# EAGLE design usb-shock-buzzer (EAGLE 7.6.0)
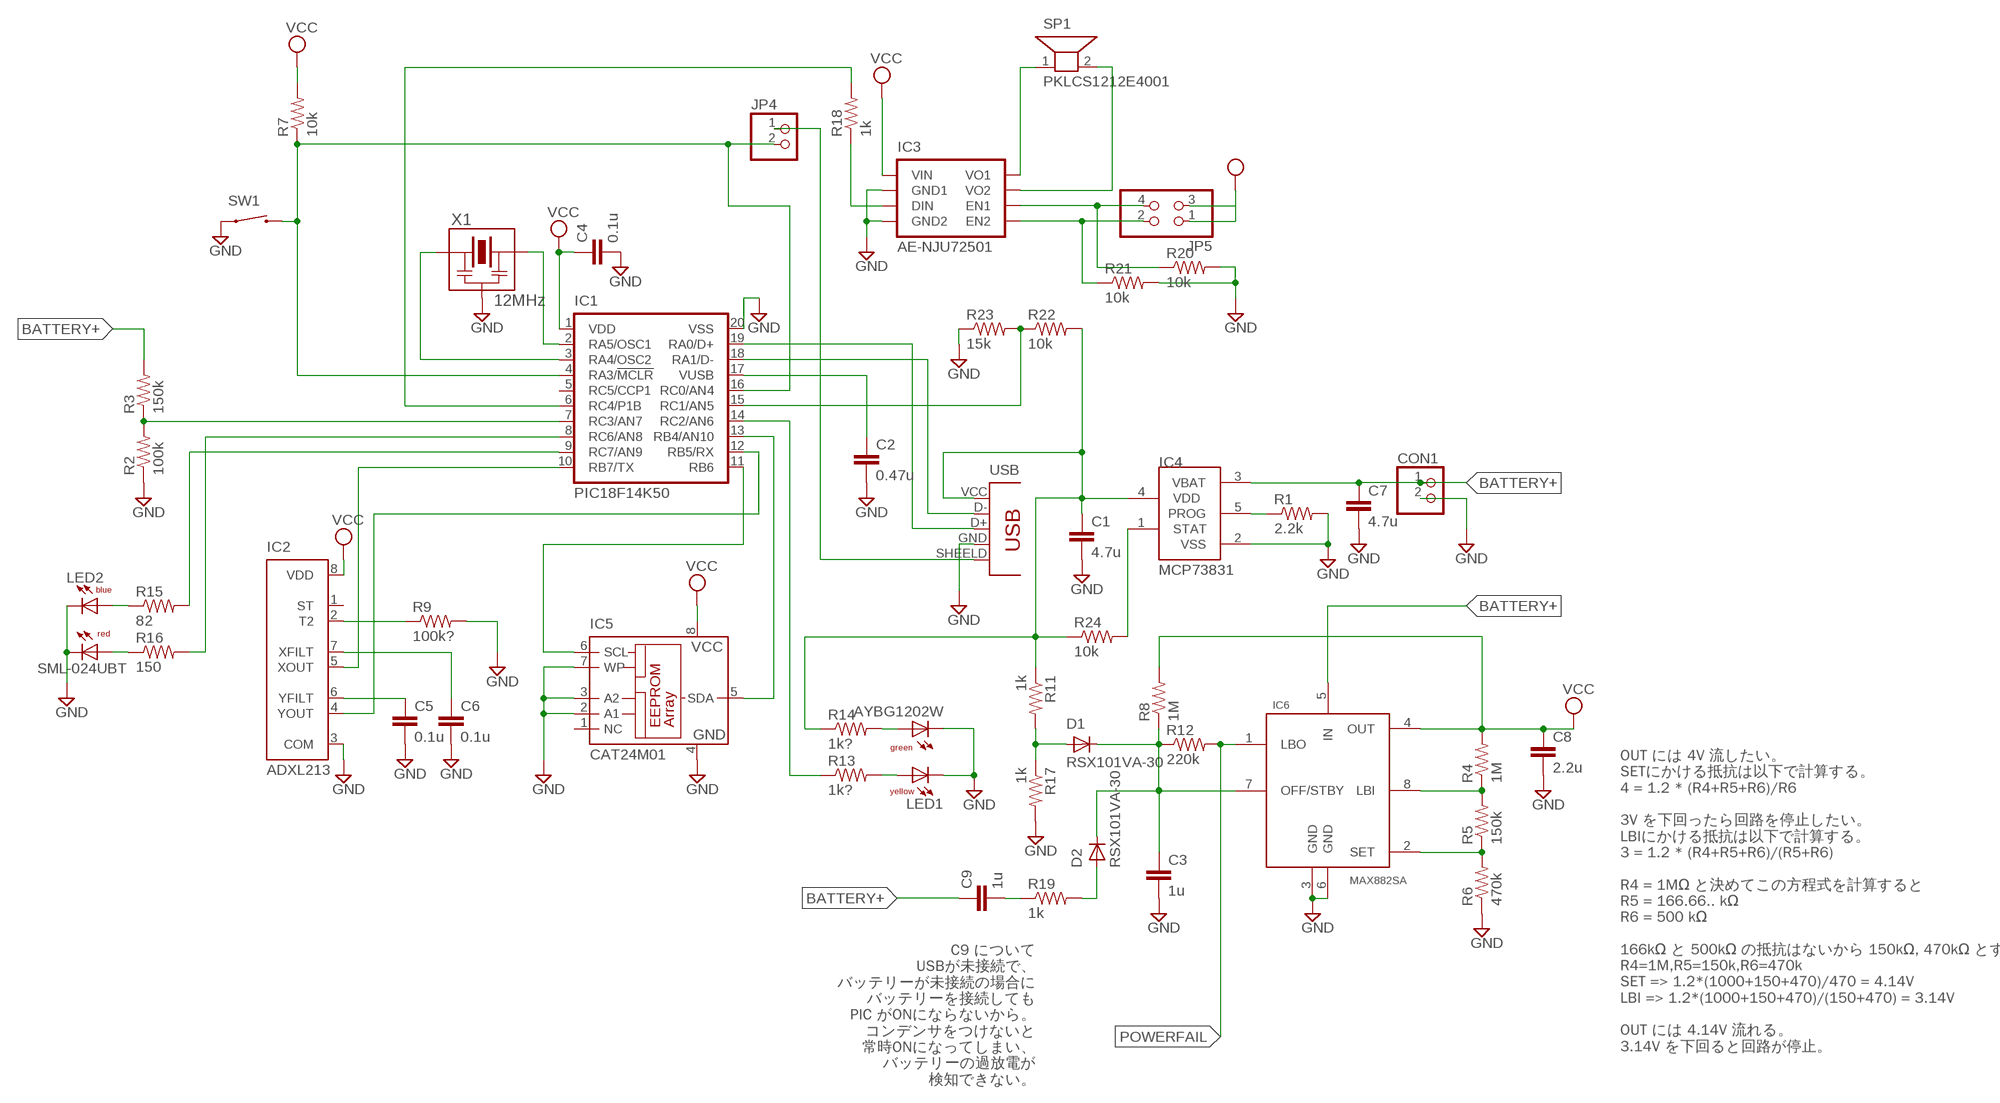
[diagram p0: schematic, sheet 1]

## Parts
C1  4.7u  C-EUC0805  [C0805]
C2  0.47u  C-EUC0805  [C0805]
C3  1u  C-EUC0805  [C0805]
C4  0.1u  C-EUC0805  [C0805]
C5  0.1u  C-EUC0805  [C0805]
C6  0.1u  C-EUC0805  [C0805]
C7  4.7u  C-EUC0805  [C0805]
C8  2.2u  C-EUC1206  [C1206]
C9  1u  C-EUC0805  [C0805]
CON1  PH-2PIN  [PH-2PIN]
D1  RSX101VA-30  [RSX101VA]
D2  RSX101VA-30  [RSX101VA]
IC1  PIC18F14K50  [SO20]
IC2  ADXL213  [LCC8]
IC3  AE-NJU72501  [AE-NJU72501]
IC4  MCP73831  [SOT23-5L]
IC5  CAT24M01  [SOIC]
IC6  MAX882SA  [8-SO]
JP4  PINHD-1X2  [1X02]
JP5  PINHD-2X2  [2X02]
LED1  AYBG1202W  [AYBG1202W]
LED2  SML-024UBT  2COLOR-BR  [SML-02]
R1  2.2k  R-US_M0805  [M0805]
R2  100k  R-US_M0805  [M0805]
R3  150k  R-US_M0805  [M0805]
R4  1M  R-US_R0805  [R0805]
R5  150k  R-US_M0805  [M0805]
R6  470k  R-US_M0805  [M0805]
R7  10k  R-US_M0805  [M0805]
R8  1M  R-US_M0805  [M0805]
R9  100k?  R-US_M0805  [M0805]
R11  1k  R-US_M0805  [M0805]
R12  220k  R-US_M0805  [M0805]
R13  1k?  R-US_M0805  [M0805]
R14  1k?  R-US_M0805  [M0805]
R15  82  R-US_M0805  [M0805]
R16  150  R-US_M0805  [M0805]
R17  1k  R-US_M0805  [M0805]
R18  1k  R-US_M0805  [M0805]
R19  1k  R-US_M0805  [M0805]
R20  10k  R-US_M0805  [M0805]
R21  10k  R-US_M0805  [M0805]
R22  10k  R-US_M0805  [M0805]
R23  15k  R-US_M0805  [M0805]
R24  10k  R-US_M0805  [M0805]
SP1  PKLCS1212E4001  [PKLCS1212E4001]
SW1  TVBP06  [TVBP06]
USB  TYPE-A+SHILED  [TYPE-A]
X1  12MHz  CSTCE12M0G15L  [CSTCE]

## Nets
BATTERY+ [Power]: C7.1 C9.1 CON1.1 IC4.3(VBAT) IC6.5(IN) R3.2
GND [Power]: C1.2 C2.2 C3.2 C4.2 C5.2 C6.2 C7.2 C8.2 CON1.2 IC1.20(VSS) IC2.3(COM) IC3.2(GND1) IC3.4(GND2) IC4.2(VSS) IC5.2(A1) IC5.3(A2) IC5.4(GND) IC5.7(WP) IC6.3(GND) IC6.6(GND) LED1.2(CC1) LED1.4(CC2) LED2.1(CC1) LED2.3(CC2) R1.2 R2.1 R6.1 R9.2 R17.2 R20.2 R21.2 R23.1 SW1.1 USB.GND X1.2(GND)
N$1 [Power]: IC3.6(EN1) JP5.4 R20.1
N$2: IC1.18(RA1/D-) USB.D-
N$3: IC1.19(RA0/D+) USB.D+
N$4: IC4.5(PROG) R1.1
N$5: IC1.9(RC7/AN9) R15.2
N$6: JP4.1 USB.SHEELD
N$7: C2.1 IC1.17(VUSB)
N$8: IC1.7(RC3/AN7) R2.2 R3.1
N$9: IC6.8(LBI) R4.1 R5.2
N$10: IC1.11(RB6) IC5.6(SCL)
N$11: IC1.13(RB4/AN10) IC5.5(SDA)
N$12: C5.1 IC2.6(YFILT)
N$13: C6.1 IC2.7(XFILT)
N$14: IC1.10(RB7/TX) IC2.5(XOUT)
N$15: IC1.12(RB5/RX) IC2.4(YOUT)
N$16: C9.2 R19.1
N$17: IC2.2(T2) R9.1
N$18: IC1.8(RC6/AN8) R16.2
N$19: IC3.8(VO1) SP1.1
N$20: IC3.7(VO2) SP1.2
N$21: IC1.4(RA3/!MCLR!) IC1.16(RC0/AN4) JP4.2 R7.1 SW1.2
N$22: LED1.3(A2) R14.2
N$23: LED1.1(A1) R13.2
N$24: LED2.4(AR) R16.1
N$25: IC3.3(DIN) R18.1
N$26: IC1.2(RA5/OSC1) X1.3(RIT)
N$27: IC1.15(RC1/AN5) R22.1 R23.2
N$28: IC1.3(RA4/OSC2) X1.1(LFT)
N$29: IC6.2(SET) R5.1 R6.2
N$30: IC1.6(RC4/P1B) R18.2
N$31: IC1.14(RC2/AN6) R13.1
N$32: D2.ANODE(A) R19.2
N$33: LED2.2(AB) R15.1
N$34: C3.1 D1.CATHODE(C) D2.CATHODE(C) IC6.7(OFF/STBY) R8.1 R12.1
N$35: D1.ANODE(A) R11.2 R17.1
N$36 [Power]: IC3.5(EN2) JP5.2 R21.1
N$37: IC4.1(STAT) R24.2
POWERFAIL: IC6.1(LBO) R12.2
USB_VCC [Power]: C1.1 IC4.4(VDD) R11.1 R14.1 R22.2 R24.1 USB.VCC
VCC [Power]: C4.1 C8.1 IC1.1(VDD) IC2.8(VDD) IC3.1(VIN) IC5.8(VCC) IC6.4(OUT) JP5.1 JP5.3 R4.2 R7.2 R8.2
Unconnected: IC1.5(RC5/CCP1) IC2.1(ST) IC5.1(NC)

## Notes on the sheet
- C9 について
  USBが未接続で、
  バッテリーが未接続の場合に
  バッテリーを接続しても
  PIC がONにならないから。
  コンデンサをつけないと
  常時ONになってしまい、
  バッテリーの過放電が
  検知できない。
- OUT には 4V 流したい。
  SETにかける抵抗は以下で計算する。
  4 = 1.2 * (R4+R5+R6)/R6
  
  3V を下回ったら回路を停止したい。
  LBIにかける抵抗は以下で計算する。
  3 = 1.2 * (R4+R5+R6)/(R5+R6)
  
  R4 = 1MΩ と決めてこの方程式を計算すると
  R5 = 166.66.. kΩ
  R6 = 500 kΩ
  
  166kΩ と 500kΩ の抵抗はないから 150kΩ, 470kΩ とする
  R4=1M,R5=150k,R6=470k
  SET => 1.2*(1000+150+470)/470 = 4.14V
  LBI => 1.2*(1000+150+470)/(150+470) = 3.14V
  
  OUT には 4.14V 流れる。
  3.14V を下回ると回路が停止。

## Library data of the parts
C1-C9 = rcl:C-EU: CAPACITOR, European symbol
CON1 = connectors:PH-2PIN
D1 D2 = diodes:RSX101VA-30
IC1 = pic18f14k50:PIC18F14K50
IC2 = adxl213:ADXL213: Low-Cost +-2 g Dual-Axis Accelerometer with Duty Cycle Output Source: http://www.analog.com/media/en/technical-documentation/data-sheets/ADXL213.pdf
IC3 = ae-nju72501:AE-NJU72501
IC4 = mcp73831:MCP73831: Miniature Single-Cell, Fully Integrated Li-Ion, Li-Polymer Charge Management Controllers
IC5 = cat24m01:CAT24M01: Serial EEPROM 1Mbit (128KB)
IC6 = max882:MAX882*: MAX882 Low-Dropout, Adjustable Linear Regulators 200 mA, 5V/3.3V This is SMD library only. Created by: Razi Raslan; Ragnar Granit Institute; Tampere University of Technology.
JP4 = pinhead:PINHD-1X2: PIN HEADER
JP5 = pinhead:PINHD-2X2: PIN HEADER
LED1 = led-smd:AYBG1202W
LED2 = led-smd:2COLOR-BR: 2color led http://akizukidenshi.com/catalog/g/gI-09437/
R1-R9 R11-R24 = rcl:R-US_: RESISTOR, American symbol
SP1 = pklcs1212e4001-r1:PKLCS1212E4001
SW1 = switches:TVBP06: 2pin switch. http://akizukidenshi.com/catalog/g/gP-08074/
USB = usb-connector:TYPE-A+SHILED
X1 = murata-ceralok:CSTCE12M0G15L: Murata CERALOCK https://jp.rs-online.com/web/p/ceramic-resonators/7926527/

## Net classes
0 default: width 0.203 mm, drill 0.203 mm, clearance 0.203 mm
1 Power: width 0.508 mm, drill 0.508 mm, clearance 0.406 mm

## Board
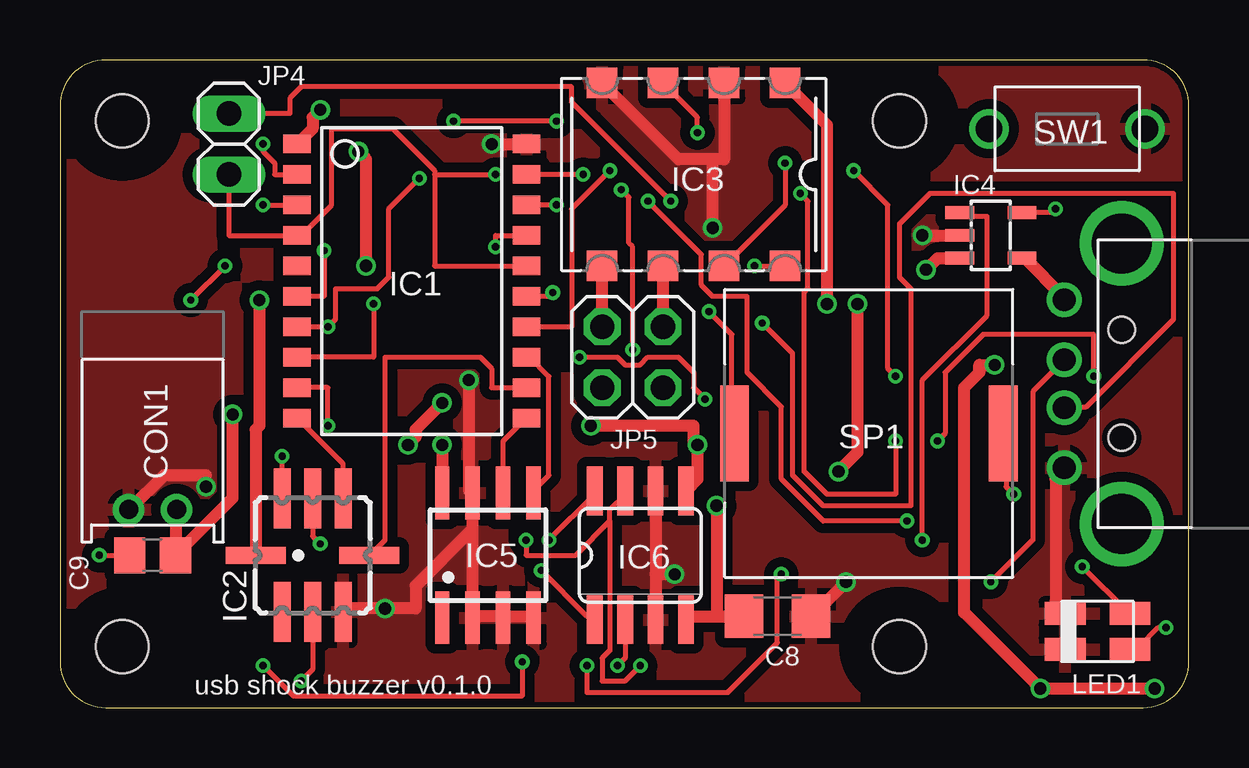
[diagram p1: board, top side]
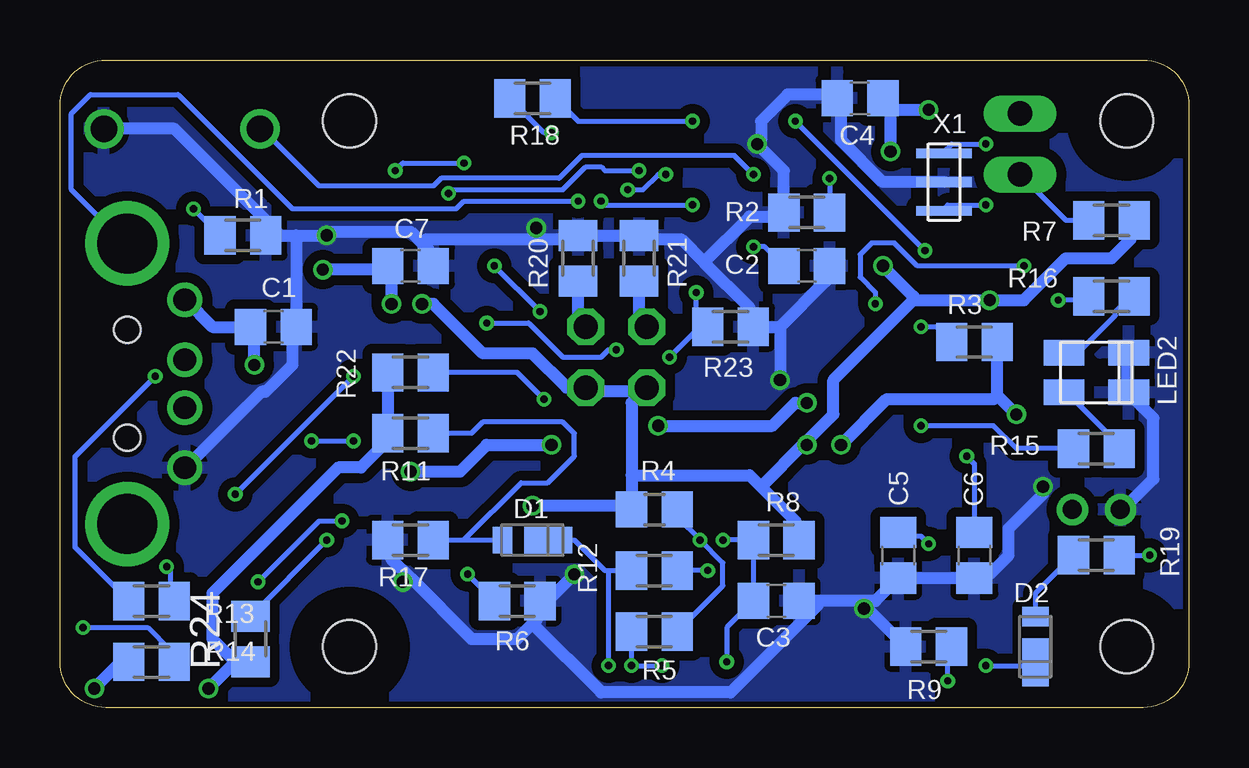
[diagram p2: board, bottom side, seen from below]

Size 47.04 x 27 mm. Coordinates in mm from the lower left corner, seen from the top.
Outline: 0,25.09 0,1.91 arc90 1.91,0 45.14,0 arc90 47.04,1.91 47.04,25.09 arc90 45.14,27 1.91,27 arc90 0,25.09
Copper layers (1*16): Top 0.035mm / dielectric 1.5mm / Bottom 0.035mm
Design rules "ssci_SeeedStudio_2layer_DRU_no_angle": minimum track width 6mil, minimum drill 12mil, track to track 6mil, track to pad 6mil, pad to pad 6mil, via to via 6mil, smd to smd 0mil, copper to edge 10mil, drill to drill 10mil, minimum pad ring 10mil, minimum via ring 6mil, stop-mask expansion 2mil, vias tented up to drill 25mil, thermal gap 10mil
Holes 2.2 mm at 34.98,24.46 34.98,2.54 2.59,2.54 2.59,24.46
bKeepout: area 11,11 to 17,17
tRestrict: area 0.1,22 to 5.1,27; area 32.5,22 to 37.5,27; area 32.5,0 to 37.5,5; area 0.1,0 to 5.1,5
bRestrict: area 32.5,22 to 37.5,27; area 32.5,0 to 37.5,5; area 0.1,0 to 5.1,5; area 0.1,22 to 5.1,27

### Footprints (pad centres in the part's own frame; a part is rotated, then mirrored left to right if it is on the bottom)
C0805 = smd 1.3 x 1.5: 1 -0.95,0; 2 0.95,0
C1206 = smd 1.6 x 1.8: 1 -1.4,0; 2 1.4,0
PH-2PIN = drill 0.8: 1 1,0; 2 -1,0
RSX101VA = smd 0.8 x 1.1: ANODE -1.25,0 | smd 2 x 1.1: CATHODE 0.65,0
SO20 = smd 0.762 x 1.143: 1 -5.08,-4.788; 2 -3.81,-4.788; 3 -2.54,-4.788; 4 -1.27,-4.788; 5 0,-4.788; 6 1.27,-4.788; 7 2.54,-4.788; 8 3.81,-4.788; 9 5.08,-4.788; 10 6.35,-4.788; 11 6.35,4.788; 12 5.08,4.788; 13 3.81,4.788; 14 2.54,4.788; 15 1.27,4.788; 16 0,4.788; 17 -1.27,4.788; 18 -2.54,4.788; 19 -3.81,4.788; 20 -5.08,4.788
LCC8 = smd 2.5 x 0.7: 1 -2.367,1.27; 2 -2.367,0; 3 -2.367,-1.27; 5 2.367,-1.27; 6 2.367,0; 7 2.367,1.27 | smd 0.7 x 2.5: 4 0,-2.367; 8 0,2.367
AE-NJU72501 = smd 1.27 x 1.27: 1 -3.81,3.81; 2 -3.81,1.27; 3 -3.81,-1.27; 4 -3.81,-3.81; 5 3.81,-3.81; 6 3.81,-1.27; 7 3.81,1.27; 8 3.81,3.81
SOT23-5L = smd 0.533 x 1.2: 1 -0.95,-1.3; 2 0,-1.3; 3 0.95,-1.3 | smd 0.55 x 1.2: 4 0.95,1.3; 5 -0.95,1.3
SOIC = smd 0.6 x 2.2: 1 -1.905,-2.6; 2 -0.635,-2.6; 3 0.635,-2.6; 4 1.905,-2.6; 5 1.905,2.6; 6 0.635,2.6; 7 -0.635,2.6; 8 -1.905,2.6
8-SO = smd 2.032 x 0.66: 1 -2.684,1.905; 2 -2.684,0.635; 3 -2.684,-0.635; 4 -2.684,-1.905; 5 2.684,-1.905; 6 2.684,-0.635; 7 2.684,0.635; 8 2.684,1.905
1X02 = drill 1.016 long: 1 -1.27,0; 2 1.27,0
2X02 = drill 1.016 octagon: 1 -1.27,-1.27; 2 -1.27,1.27; 3 1.27,-1.27; 4 1.27,1.27
AYBG1202W = smd 0.95 x 1.7: 1 -0.75,1.35; 2 -0.75,-1.35; 3 0.75,1.35; 4 0.75,-1.35
SML-02 = smd 1.7 x 1.05: 1 -1.35,0.825; 2 1.35,0.825; 3 -1.35,-0.825; 4 1.35,-0.825
M0805 = smd 1.3 x 1.6: 1 -0.95,0; 2 0.95,0
R0805 = smd 1.3 x 1.5: 1 -0.95,0; 2 0.95,0
PKLCS1212E4001 = smd 1.2 x 4: 1 -5.6,0; 2 5.6,0
TVBP06 = drill 1.1: 1 -3.25,0; 2 3.25,0
TYPE-A = drill 0.95: D+ 1,0; D- -1,0; GND 3.5,0; VCC -3.5,0 | drill 2.5: SHEELD -5.85,2.4; SHEELD2 5.85,2.4 | hole 1.1: -2.25,2.4; 2.25,2.4
CSTCE = smd 0.4 x 2.3: 1 1.2,0; 2 0,0; 3 -1.2,0

### Placement (x,y rotation side)
C1  38.15,15.88 0 bottom
C2  15.92,18.41 0 bottom
C3  17.2,4.45 0 bottom
C4  13.7,25.4 180 bottom
C5  12.11,6.35 270 bottom
C6  8.94,6.35 270 bottom
C7  32.44,18.41 0 bottom
C8  29.9,3.81 0 top
C9  3.86,6.35 180 top
CON1  3.86,8.26 0 top
D1  27.35,6.99 0 bottom
D2  6.4,2.54 270 bottom
IC1  14.66,18.41 270 top
IC2  10.53,6.35 90 top
IC3  26.4,22.23 270 top
IC4  38.78,19.68 270 top
IC5  17.83,6.35 0 top
IC6  24.18,6.35 90 top
JP4  7.04,23.5 270 top
JP5  23.86,14.61 0 top
LED1  43.23,3.17 270 top
LED2  3.86,13.97 180 bottom
R1  39.42,19.68 0 bottom
R2  15.92,20.64 0 bottom
R3  8.94,15.24 0 bottom
R4  22.27,8.26 180 bottom
R5  22.27,3.17 0 bottom
R6  27.99,4.45 180 bottom
R7  3.23,20.32 0 bottom
R8  17.2,6.99 0 bottom
R9  10.84,2.54 180 bottom
R11  32.44,11.43 0 bottom
R12  22.27,5.71 0 bottom
R13  43.23,4.45 0 bottom
R14  43.23,1.91 0 bottom
R15  3.86,10.79 180 bottom
R16  3.23,17.14 180 bottom
R17  32.44,6.99 180 bottom
R18  27.35,25.4 0 bottom
R19  3.86,6.35 180 bottom
R20  25.45,18.73 90 bottom
R21  22.91,18.73 90 bottom
R22  32.44,13.97 180 bottom
R23  19.1,15.88 180 bottom
R24  39.1,2.86 90 bottom
SP1  33.7,11.43 0 top
SW1  41.96,24.13 180 top
USB  41.84,13.5 270 top
X1  10.21,21.91 270 bottom

### Tracks (layer width: path | path; a pad name or v marks a point on that pad's centre or on a via)
BATTERY+  (via drill 0.51)
  Top 0.508: CON1.1 4.81,8.26 C9.1 4.97,6.51 7.19,8.73 v7.19,12.22 | v36.09,18.26 36.56,18.73 37.36,18.73 IC4.3 | v32.44,9.84 33.23,10.64 v33.23,16.83 | IC6.5 26.09,9.05 26.56,9.53 v26.56,10.95 26.4,11.11 26.4,11.75 v22.12,11.75 | v14.5,10.95 14.81,11.27 14.81,11.59 v15.92,12.7
  Bottom 0.508: 7.99,13.02 R3.2 | v7.19,12.22 7.99,13.02 | v36.09,18.26 33.55,18.26 C7.1 33.23,18.26 v33.23,16.83 | v26.56,10.95 29.26,10.95 30.37,9.84 v32.44,9.84 | v14.5,10.95 12.59,12.86 8.15,12.86 7.99,13.02 | v15.92,12.7 16.4,12.7 17.35,11.75 v22.12,11.75
GND  (via drill 0.51)
  Top 0.508: IC5.4 19.73,3.81 18.62,3.81 IC5.3 18.47,3.81 17.2,3.81 IC5.2 17.2,7.3 | 17.2,7.3 IC5.7 17.04,9.05 v17.04,13.65 | IC2.3 11.8,4.13 v13.54,4.13 14.81,4.13 14.81,5.08 17.04,7.3 17.2,7.3 | IC6.6 24.81,5.56 | 24.81,5.56 IC6.3 | v32.75,5.24 31.32,3.81 C8.2 | v25.61,5.56 24.81,5.56 | v6.08,9.21 6.08,9.68 4.34,9.68 2.91,8.26 CON1.2 | v17.99,23.5 IC1.20 | LED1.4 41.96,2.54 41.96,3.81 LED1.2 41.8,4.13 41.48,4.45 41.48,9.53 41.8,9.84 USB.GND | IC3.4 25.77,22.86 27.2,22.86 | 27.2,22.86 27.67,22.86 IC3.2 | v35.93,19.68 IC4.2 | v27.2,20 27.2,22.86
  Bottom 0.508: 27.35,3.49 27.99,2.86 29.9,2.86 32.44,5.4 | 27.35,3.49 27.2,3.65 27.2,4.45 R6.1 26.88,4.29 v25.61,5.56 | 32.44,5.4 33.23,6.19 33.23,6.99 R17.2 | v32.75,5.24 32.59,5.24 32.44,5.4 | LED2.3 2.59,14.76 2.59,13.18 LED2.1 2.43,13.02 1.48,12.06 1.48,9.53 2.75,8.26 CON1.2 | 13.54,4.45 13.07,4.45 12.27,5.24 C5.2 C6.2 8.78,5.56 8.3,5.56 7.51,6.35 7.51,7.46 6.08,8.89 v6.08,9.21 | 13.54,4.45 15.45,4.45 | 15.45,4.45 C3.2 | 13.46,4.21 13.54,4.29 13.54,4.45 | 13.46,4.21 R9.2 | 27.35,3.49 24.5,0.64 19.1,0.64 15.45,4.29 15.45,4.45 | v13.54,4.13 13.46,4.21 | X1.2 12.75,21.91 14.5,23.65 14.5,25.4 C4.2 14.81,25.56 16.72,25.56 17.83,24.45 17.83,23.65 v17.99,23.5 16.88,22.38 R2.1 17.04,20.48 18.31,20.48 20.21,18.57 | 17.04,15.88 15.13,17.78 15.13,18.41 C2.2 | 17.04,15.88 R23.1 18.31,16.03 18.31,16.67 20.21,18.57 | 37.2,19.68 R1.2 37.99,19.84 42.28,24.13 SW1.1 | 37.2,19.68 v35.93,19.68 35.77,19.84 32.44,19.84 31.96,19.37 | 37.2,19.68 C1.2 37.36,15.72 37.36,14.29 38.47,13.18 38.63,13.18 41.8,10 USB.GND | 31.96,19.37 31.64,19.05 31.64,18.41 C7.2 | 27.2,19.53 31.8,19.53 31.96,19.37 | 27.2,19.53 25.61,19.53 R20.2 R21.2 22.75,19.53 21.16,19.53 20.21,18.57 | 27.2,19.53 v27.2,20 | 17.04,15.88 v17.04,13.65
  pour Top: 0.05,27 47.04,27 47.04,0 0.05,0
  pour Bottom: 0.05,27 47.04,27 47.04,0 0.05,0
N$1
  Top 0.508: JP5.4 IC3.6
  Bottom 0.508: R20.1 25.45,16.19 JP5.4
N$2  (via drill 0.3)
  Top 0.203: v20.69,20.95 IC1.18 | v24.5,21.11 26.72,18.89 26.72,17.62 27.2,17.14 28.62,17.14 28.62,13.97 30.05,12.54 30.05,9.53 31.8,7.78 v35.29,7.78 | v38.78,5.24 40.53,6.99 40.53,13.18 41.8,14.45 USB.D-
  Bottom 0.203: v20.69,20.95 24.34,20.95 v24.5,21.11 | v35.29,7.78 36.24,7.78 v38.78,5.24
N$3  (via drill 0.3)
  Top 0.203: v21.8,22.23 IC1.19 | v23.39,21.59 23.7,21.27 23.7,19.37 23.86,19.21 v23.86,14.92 | v29.26,16.03 30.53,14.76 30.53,9.68 31.8,8.41 35.45,8.41 35.45,17.46 34.98,17.94 34.98,20.16 36.24,21.43 46.41,21.43 46.41,16.19 42.75,12.54 41.96,12.54 USB.D+
  Bottom 0.203: v21.8,22.23 22.12,22.23 22.75,21.59 v23.39,21.59 | v23.86,14.92 24.18,14.92 24.5,14.61 26.09,14.61 27.51,16.03 v29.26,16.03
N$4  (via drill 0.3)
  Top 0.203: v41.48,20.8 41.48,20.64 40.21,20.64 IC4.5
  Bottom 0.203: v41.48,20.8 R1.1
N$5  (via drill 0.3)
  Top 0.203: IC1.9 11.16,13.34 v11.16,11.75
  Bottom 0.203: v11.16,11.75 8.15,11.75 7.19,10.79 R15.2
N$6  (via drill 0.3)
  Top 0.203: JP4.1 9.57,24.77 9.57,25.4 10.05,25.88 21.32,25.88 21.32,25.24 v25.45,21.11
  Bottom 0.203: v25.45,21.11 30.21,21.11 30.53,20.8 37.36,20.8 42.12,25.56 45.77,25.56 46.56,24.77 46.56,21.59 44.34,19.37 USB.SHEELD
N$7  (via drill 0.3)
  Top 0.203: IC1.17 18.15,19.68 v18.15,19.21
  Bottom 0.203: v18.15,19.21 17.67,19.21 C2.1
N$8  (via drill 0.3)
  Top 0.203: IC1.7 v11.16,15.88 11.48,16.19 11.48,17.46 13.23,17.46 13.7,17.94 13.7,20.8 v14.97,22.07
  Bottom 0.203: v11.16,15.88 10.53,15.88 R3.1 | v14.97,22.07 R2.2
N$9  (via drill 0.3)
  Top 0.203: v20.37,6.99 22.27,8.89 IC6.8
  Bottom 0.203: R4.1 21.32,7.94 v20.37,6.99 19.42,6.03 19.42,5.08 R5.2
N$10
  Top 0.203: IC5.6 18.47,11.11 19.42,12.06 IC1.11
N$11
  Top 0.203: IC1.13 19.58,14.61 20.37,13.81 20.37,9.68 19.73,9.05 IC5.5
N$12  (via drill 0.3)
  Top 0.203: v10.84,6.83 10.53,7.14 IC2.6
  Bottom 0.203: v10.84,6.83 11.16,7.14 12.11,7.14 C5.1
N$13  (via drill 0.3)
  Top 0.203: IC2.7 v9.26,10.48
  Bottom 0.203: C6.1 8.94,10.16 v9.26,10.48
N$14
  Top 0.203: IC2.5 11.8,10.16 9.89,12.06 IC1.10
N$15
  Top 0.203: IC1.12 17.99,13.34 17.99,14.13 17.51,14.61 13.54,14.61 13.54,6.99 12.91,6.35 IC2.4
N$16  (via drill 0.3)
  Top 0.203: v1.64,6.35 R19.1
  Bottom 0.203: R19.1 v1.64,6.35
N$17  (via drill 0.3)
  Top 0.203: v10.05,1.11 10.53,1.59 IC2.2
  Bottom 0.203: v10.05,1.11 10.05,2.54 R9.1
N$18  (via drill 0.3)
  Top 0.203: IC1.8 13.07,14.61 v13.07,16.83 | v5.45,16.99 v6.88,18.41
  Bottom 0.203: v13.07,16.83 13.07,17.3 13.7,17.94 13.7,18.89 13.23,19.37 12.27,19.37 11.32,18.41 v6.88,18.41 | v5.45,16.99 4.34,16.99 R16.2
N$19  (via drill 0.3)
  Top 0.203: v28.94,18.41 IC3.8 | v27.04,16.51 27.99,15.56 27.99,11.43 SP1.1
  Bottom 0.203: v27.04,16.51 v28.94,18.41
N$20  (via drill 0.3)
  Top 0.203: IC3.7 30.21,20.95 v30.21,22.7 | v33.07,22.38 34.5,20.95 34.5,14.13 v34.82,13.81 | v39.74,8.89 39.42,9.21 39.42,11.43 SP1.2
  Bottom 0.203: v30.21,22.7 32.75,22.7 v33.07,22.38 | v39.74,8.89 v34.82,13.81
N$21  (via drill 0.3)
  Top 0.203: JP4.2 7.04,19.68 IC1.4 10.05,19.68 11.32,20.95 11.32,24.13 13.86,24.13 15.61,22.38 15.61,22.23 | IC1.16 15.61,18.41 15.61,22.23 | 15.61,22.23 v18.15,22.23
  Bottom 0.203: R7.1 5.13,20.32 JP4.2 | v18.15,22.23 18.94,23.02 25.29,23.02 26.24,22.07 31.16,22.07 31.48,21.75 36.24,21.75 38.63,24.13 SW1.2
N$22  (via drill 0.3)
  Top 0.203: v46.09,3.33 45.77,3.33 44.98,2.54 44.66,2.54 LED1.3
  Bottom 0.203: v46.09,3.33 43.39,3.33 42.44,2.38 42.44,1.91 R14.2
N$23  (via drill 0.3)
  Top 0.203: v42.59,5.87 44.5,3.97 LED1.1
  Bottom 0.203: v42.59,5.87 42.44,5.71 42.44,4.45 R13.2
N$24
  Bottom 0.203: R16.1 2.43,17.14 3.07,16.51 3.07,16.35 4.5,14.92 5.13,14.92 LED2.4
N$25  (via drill 0.3)
  Top 0.203: IC3.3 26.56,24.61 v26.56,23.97
  Bottom 0.203: v26.56,23.97 26.88,23.97 R18.1
N$26  (via drill 0.3)
  Top 0.203: IC1.2 8.94,22.23 8.94,22.7 8.46,23.18 v8.46,23.5
  Bottom 0.203: v8.46,23.5 9.89,23.5 10.21,23.18 X1.3
N$27  (via drill 0.3)
  Top 0.203: IC1.15 20.53,17.14 v20.53,17.3 | v26.88,12.86 26.4,13.34 26.4,13.97 25.77,14.61 24.5,14.61 24.18,14.29 23.55,14.29 23.23,14.61 v21.64,14.61
  Bottom 0.203: v20.53,17.3 20.53,16.35 20.21,16.03 | 20.21,16.03 R23.2 20.21,16.03 | R22.1 27.99,13.97 v26.88,12.86 | 20.21,16.03 v21.64,14.61
N$28  (via drill 0.3)
  Top 0.203: v8.46,20.95 IC1.3
  Bottom 0.203: v8.46,20.95 10.05,20.95 10.21,20.8 X1.1
N$29  (via drill 0.3)
  Top 0.203: v23.23,1.75 23.55,2.06 IC6.2 | v30.05,5.56 29.9,5.4 29.9,2.7 27.83,0.64 21.96,0.64 v21.96,1.75
  Bottom 0.203: R5.1 v23.23,1.75 v21.96,1.75 | v30.05,5.56 R6.2
N$30  (via drill 0.3)
  Top 0.203: IC1.6 11,17.14 v11,19.05 | v20.69,24.45 v16.4,24.45
  Bottom 0.203: v16.4,24.45 v11,19.05 | v20.69,24.45 25.45,24.45 R18.2
N$31  (via drill 0.3)
  Top 0.203: IC1.14 21.32,15.88 21.32,20.8 v22.91,22.38 | v30.85,21.43 31.16,21.11 31.16,17.46 31.01,17.3 31.01,9.84 31.96,8.89 34.82,8.89 v34.82,11.11 | v36.56,11.11 36.88,11.43 36.88,13.97 38.47,15.56 43.07,15.56 v43.07,13.81
  Bottom 0.203: v22.91,22.38 24.34,22.38 24.5,22.54 25.13,22.54 26.09,21.59 30.69,21.59 v30.85,21.43 | v36.56,11.11 v34.82,11.11 | v43.07,13.81 46.41,10.48 46.41,6.67 R13.1
N$32
  Bottom 0.203: D2.ANODE 6.4,4.76 R19.2
N$33
  Bottom 0.203: R15.1 3.07,10.79 3.07,11.11 5.13,13.18 LED2.2
N$34  (via drill 0.3)
  Top 0.203: v8.46,1.75 9.73,0.48 19.26,0.48 v19.26,1.91 | 22.91,7.78 22.91,8.26 23.55,8.89 IC6.7 | 22.91,7.78 21.48,6.35 19.42,6.35 v19.42,6.99 | v24.18,1.75 23.55,1.11 22.59,1.11 22.59,2.06 22.91,2.38 22.91,7.78
  Bottom 0.203: 24.18,5.71 24.34,5.71 25.61,6.99 D1.CATHODE | 24.18,5.71 R12.1 | R8.1 C3.1 | v8.46,1.75 6.4,1.75 D2.CATHODE | v19.26,1.91 19.26,3.33 C3.1 | C3.1 | R8.1 v19.42,6.99 | R8.1 | v24.18,1.75 24.18,5.71
N$35
  Bottom 0.203: R17.1 30.21,6.99 | 30.21,6.99 D1.ANODE | R11.2 29.9,11.43 29.42,11.91 26.09,11.91 25.61,11.43 25.61,10.48 26.72,9.37 27.83,9.37 30.21,6.99
N$36
  Top 0.508: JP5.2 IC3.5
  Bottom 0.508: R21.1 22.91,16.19 JP5.2
N$37  (via drill 0.3)
  Top 0.203: v35.93,6.99 35.93,13.65 38.63,16.35 38.63,20.48 37.52,20.48 IC4.1
  Bottom 0.203: v35.93,6.99 R24.2
POWERFAIL  (via drill 0.3)
  Top 0.203: v20.05,5.71 21.96,3.81 22.27,3.81 IC6.1
  Bottom 0.203: v20.05,5.71 R12.2
USB_VCC  (via drill 0.51)
  Top 0.508: IC4.4 40.21,18.73 41.8,17.14 USB.VCC | v45.61,0.79 v40.85,0.79 37.67,3.97 37.67,13.34 38.31,13.97 38.31,14.29 v38.94,14.29
  Bottom 0.508: USB.VCC 41.8,16.99 40.69,15.88 C1.1 38.94,15.72 v38.94,14.29 | R22.2 R11.1 33.23,11.27 34.5,10 35.45,10 40.69,4.76 40.69,2.86 39.9,2.06 39.1,2.06 R24.1 39.74,1.91 v40.85,0.79 | R14.1 44.5,1.91 v45.61,0.79
VCC  (via drill 0.51)
  Top 0.508: IC3.1 31.96,24.29 v31.96,16.83 | v10.84,24.92 10.53,24.61 10.53,24.13 9.89,23.5 IC1.1 | 27.35,3.81 26.09,3.81 IC6.4 | 27.35,3.81 C8.1 | v15.92,10.95 IC5.8 | v8.3,16.99 8.3,11.75 8.15,11.59 8.15,6.35 IC2.8 | v27.35,8.41 27.35,3.81 | v12.43,23.18 12.75,22.86 v12.75,18.41
  Bottom 0.508: v31.96,16.83 31.48,16.83 29.42,14.76 27.35,14.76 25.93,13.34 JP5.3 24.97,13.18 23.07,13.18 JP5.1 23.23,12.7 23.23,9.68 | v10.84,24.92 12.27,24.92 C4.1 12.43,24.77 v12.43,23.18 | 23.23,9.68 R4.2 23.39,8.41 v27.35,8.41 | 17.83,9.21 18.31,9.68 23.23,9.68 | 17.83,9.21 16.4,7.78 16.4,6.99 R8.2 | 11.48,16.99 v8.3,16.99 6.88,16.99 5.13,18.73 3.23,18.73 2.43,19.53 2.43,20.32 R7.2 | 11.48,16.99 14.81,13.65 14.81,12.22 16,11.03 | 17.83,9.21 16,11.03 | v15.92,10.95 16,11.03 | v12.75,18.41 11.48,17.14 11.48,16.99

### Text on the board
tPlace: usb shock buzzer v0.1.0